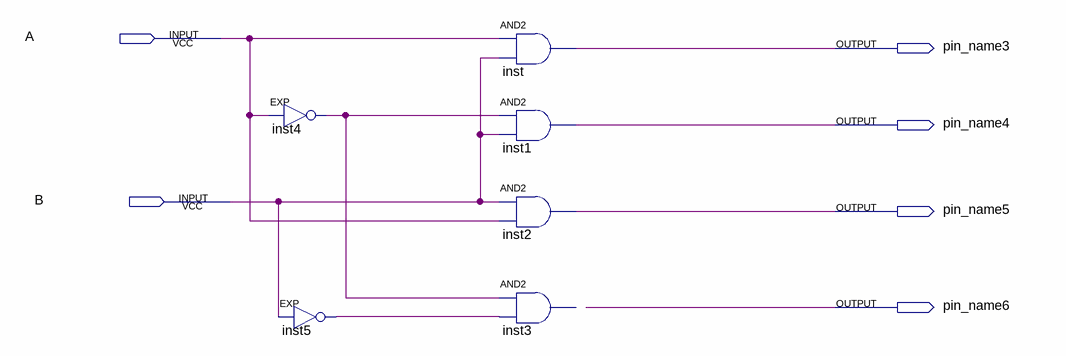
[diagram p0: schematic sheet]
// Quartus schematic dec.bdf as structural Verilog: 6 symbols, 6 pins
module dec (
  input  A,
  input  B,
  output pin_name3,
  output pin_name4,
  output pin_name5,
  output pin_name6
);

  wire inst4_out, inst5_out;

  EXP inst4 (.IN(A), .OUT(inst4_out));
  EXP inst5 (.IN(B), .OUT(inst5_out));
  and inst (pin_name3, A, B);
  and inst1 (pin_name4, inst4_out, B);
  and inst2 (pin_name5, B, A);
  // AND2 inst3 has open pins: IN1=inst4_out, IN2=inst5_out, OUT=open
endmodule
